# Altium project led_2835_curve_45X45cm.PrjPcb
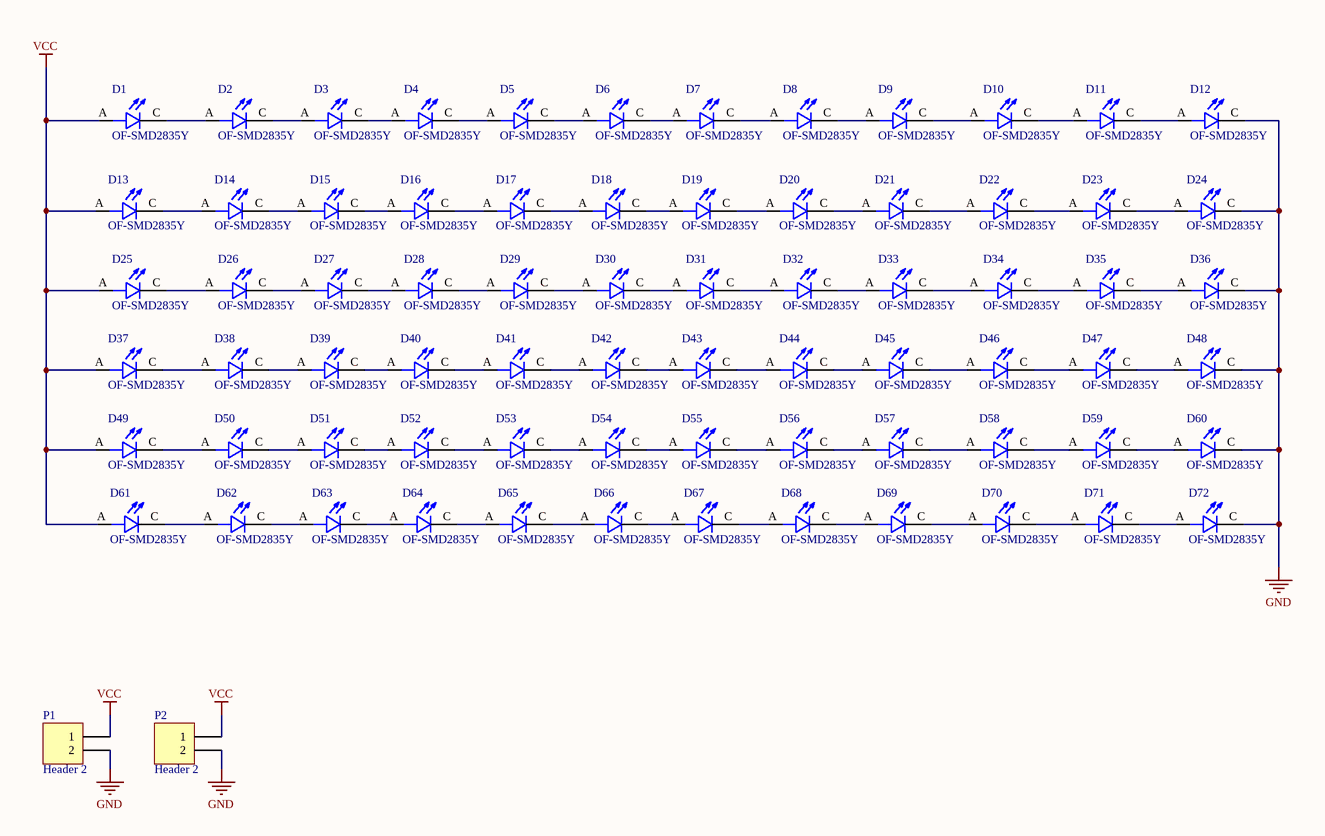
[diagram p0: led_2835_curve_45X45cm.SchDoc]
1 sheet, 74 parts. Net scope: global (net labels, ports and power ports of the same name join across sheets).
Board file: led_2835_curve_45X45cm.PcbDoc

## Sheet led_2835_curve_45X45cm.SchDoc
size A3; SheetNumber: 1; SheetTotal: 1

### Parts
D1  OF-SMD2835Y  [LED_OF-SMD2835Y]
D2  OF-SMD2835Y  [LED_OF-SMD2835Y]
D3  OF-SMD2835Y  [LED_OF-SMD2835Y]
D4  OF-SMD2835Y  [LED_OF-SMD2835Y]
D5  OF-SMD2835Y  [LED_OF-SMD2835Y]
D6  OF-SMD2835Y  [LED_OF-SMD2835Y]
D7  OF-SMD2835Y  [LED_OF-SMD2835Y]
D8  OF-SMD2835Y  [LED_OF-SMD2835Y]
D9  OF-SMD2835Y  [LED_OF-SMD2835Y]
D10  OF-SMD2835Y  [LED_OF-SMD2835Y]
D11  OF-SMD2835Y  [LED_OF-SMD2835Y]
D12  OF-SMD2835Y  [LED_OF-SMD2835Y]
D13  OF-SMD2835Y  [LED_OF-SMD2835Y]
D14  OF-SMD2835Y  [LED_OF-SMD2835Y]
D15  OF-SMD2835Y  [LED_OF-SMD2835Y]
D16  OF-SMD2835Y  [LED_OF-SMD2835Y]
D17  OF-SMD2835Y  [LED_OF-SMD2835Y]
D18  OF-SMD2835Y  [LED_OF-SMD2835Y]
D19  OF-SMD2835Y  [LED_OF-SMD2835Y]
D20  OF-SMD2835Y  [LED_OF-SMD2835Y]
D21  OF-SMD2835Y  [LED_OF-SMD2835Y]
D22  OF-SMD2835Y  [LED_OF-SMD2835Y]
D23  OF-SMD2835Y  [LED_OF-SMD2835Y]
D24  OF-SMD2835Y  [LED_OF-SMD2835Y]
D25  OF-SMD2835Y  [LED_OF-SMD2835Y]
D26  OF-SMD2835Y  [LED_OF-SMD2835Y]
D27  OF-SMD2835Y  [LED_OF-SMD2835Y]
D28  OF-SMD2835Y  [LED_OF-SMD2835Y]
D29  OF-SMD2835Y  [LED_OF-SMD2835Y]
D30  OF-SMD2835Y  [LED_OF-SMD2835Y]
D31  OF-SMD2835Y  [LED_OF-SMD2835Y]
D32  OF-SMD2835Y  [LED_OF-SMD2835Y]
D33  OF-SMD2835Y  [LED_OF-SMD2835Y]
D34  OF-SMD2835Y  [LED_OF-SMD2835Y]
D35  OF-SMD2835Y  [LED_OF-SMD2835Y]
D36  OF-SMD2835Y  [LED_OF-SMD2835Y]
D37  OF-SMD2835Y  [LED_OF-SMD2835Y]
D38  OF-SMD2835Y  [LED_OF-SMD2835Y]
D39  OF-SMD2835Y  [LED_OF-SMD2835Y]
D40  OF-SMD2835Y  [LED_OF-SMD2835Y]
D41  OF-SMD2835Y  [LED_OF-SMD2835Y]
D42  OF-SMD2835Y  [LED_OF-SMD2835Y]
D43  OF-SMD2835Y  [LED_OF-SMD2835Y]
D44  OF-SMD2835Y  [LED_OF-SMD2835Y]
D45  OF-SMD2835Y  [LED_OF-SMD2835Y]
D46  OF-SMD2835Y  [LED_OF-SMD2835Y]
D47  OF-SMD2835Y  [LED_OF-SMD2835Y]
D48  OF-SMD2835Y  [LED_OF-SMD2835Y]
D49  OF-SMD2835Y  [LED_OF-SMD2835Y]
D50  OF-SMD2835Y  [LED_OF-SMD2835Y]
D51  OF-SMD2835Y  [LED_OF-SMD2835Y]
D52  OF-SMD2835Y  [LED_OF-SMD2835Y]
D53  OF-SMD2835Y  [LED_OF-SMD2835Y]
D54  OF-SMD2835Y  [LED_OF-SMD2835Y]
D55  OF-SMD2835Y  [LED_OF-SMD2835Y]
D56  OF-SMD2835Y  [LED_OF-SMD2835Y]
D57  OF-SMD2835Y  [LED_OF-SMD2835Y]
D58  OF-SMD2835Y  [LED_OF-SMD2835Y]
D59  OF-SMD2835Y  [LED_OF-SMD2835Y]
D60  OF-SMD2835Y  [LED_OF-SMD2835Y]
D61  OF-SMD2835Y  [LED_OF-SMD2835Y]
D62  OF-SMD2835Y  [LED_OF-SMD2835Y]
D63  OF-SMD2835Y  [LED_OF-SMD2835Y]
D64  OF-SMD2835Y  [LED_OF-SMD2835Y]
D65  OF-SMD2835Y  [LED_OF-SMD2835Y]
D66  OF-SMD2835Y  [LED_OF-SMD2835Y]
D67  OF-SMD2835Y  [LED_OF-SMD2835Y]
D68  OF-SMD2835Y  [LED_OF-SMD2835Y]
D69  OF-SMD2835Y  [LED_OF-SMD2835Y]
D70  OF-SMD2835Y  [LED_OF-SMD2835Y]
D71  OF-SMD2835Y  [LED_OF-SMD2835Y]
D72  OF-SMD2835Y  [LED_OF-SMD2835Y]
P1  Header 2  [HDR1X2_SMD]
P2  Header 2  [HDR1X2_SMD]

### Nets
GND: D12.C D24.C D36.C D48.C D60.C D72.C P1.2 P2.2
VCC: D1.A D13.A D25.A D37.A D49.A D61.A P1.1 P2.1
NetD1_C: D1.C D2.A
NetD2_C: D2.C D3.A
NetD3_C: D3.C D4.A
NetD4_C: D4.C D5.A
NetD5_C: D5.C D6.A
NetD6_C: D6.C D7.A
NetD7_C: D7.C D8.A
NetD8_C: D8.C D9.A
NetD9_C: D9.C D10.A
NetD10_C: D10.C D11.A
NetD11_C: D11.C D12.A
NetD13_C: D13.C D14.A
NetD14_C: D14.C D15.A
NetD15_C: D15.C D16.A
NetD16_C: D16.C D17.A
NetD17_C: D17.C D18.A
NetD18_C: D18.C D19.A
NetD19_C: D19.C D20.A
NetD20_C: D20.C D21.A
NetD21_C: D21.C D22.A
NetD22_C: D22.C D23.A
NetD23_C: D23.C D24.A
NetD25_C: D25.C D26.A
NetD26_C: D26.C D27.A
NetD27_C: D27.C D28.A
NetD28_C: D28.C D29.A
NetD29_C: D29.C D30.A
NetD30_C: D30.C D31.A
NetD31_C: D31.C D32.A
NetD32_C: D32.C D33.A
NetD33_C: D33.C D34.A
NetD34_C: D34.C D35.A
NetD35_C: D35.C D36.A
NetD37_C: D37.C D38.A
NetD38_C: D38.C D39.A
NetD39_C: D39.C D40.A
NetD40_C: D40.C D41.A
NetD41_C: D41.C D42.A
NetD42_C: D42.C D43.A
NetD43_C: D43.C D44.A
NetD44_C: D44.C D45.A
NetD45_C: D45.C D46.A
NetD46_C: D46.C D47.A
NetD47_C: D47.C D48.A
NetD49_C: D49.C D50.A
NetD50_C: D50.C D51.A
NetD51_C: D51.C D52.A
NetD52_C: D52.C D53.A
NetD53_C: D53.C D54.A
NetD54_C: D54.C D55.A
NetD55_C: D55.C D56.A
NetD56_C: D56.C D57.A
NetD57_C: D57.C D58.A
NetD58_C: D58.C D59.A
NetD59_C: D59.C D60.A
NetD61_C: D61.C D62.A
NetD62_C: D62.C D63.A
NetD63_C: D63.C D64.A
NetD64_C: D64.C D65.A
NetD65_C: D65.C D66.A
NetD66_C: D66.C D67.A
NetD67_C: D67.C D68.A
NetD68_C: D68.C D69.A
NetD69_C: D69.C D70.A
NetD70_C: D70.C D71.A
NetD71_C: D71.C D72.A

### Library data of the parts
D1-D72 = OF-SMD2835Y: LED; SMD; 2835, PLCC2; yellow; 2200-2800mcd; 2.8x3.5x0.75mm; 120Â°; Availability: Unavailable; MP: OF-SMD2835Y; Value: *; Package: None; Price: None
P1 P2 = Header 2: Header, 2-Pin; LatestRevisionDate: 17-Jul-2002; LatestRevisionNote: Re-released for DXP Platform.; Publisher: Altium Limited